# Altium schematic sheet MB_downlink_phy.SchDoc
size A4
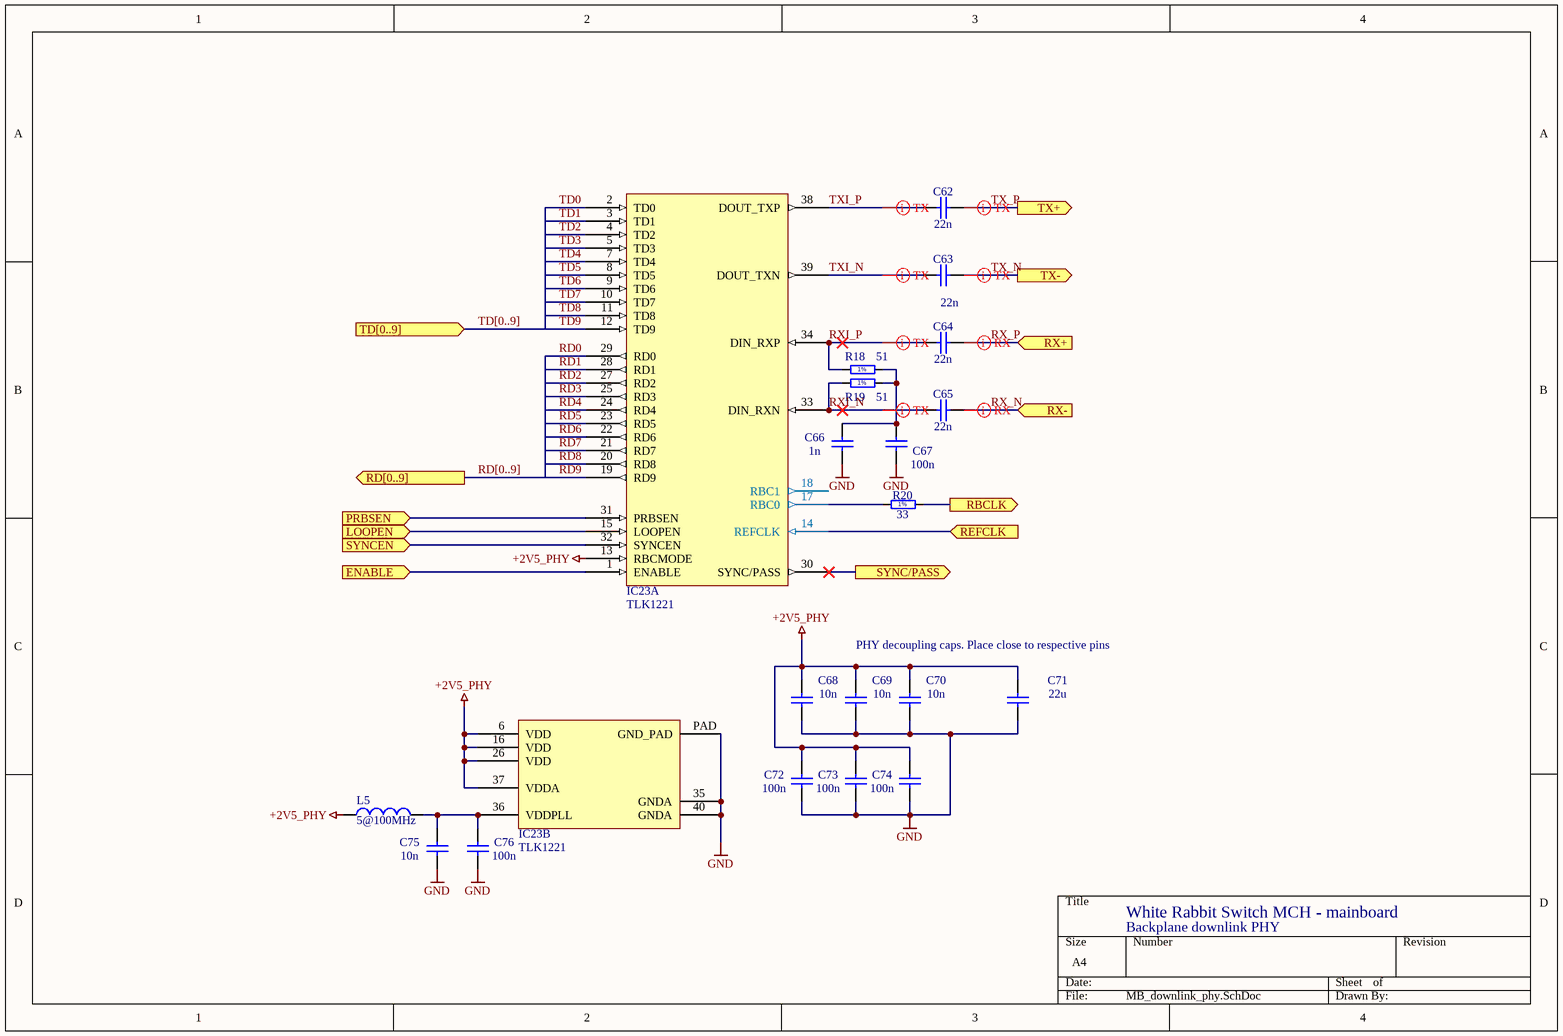
[diagram p0: MB_downlink_phy.SchDoc]

## Parts
C62  22n  [CAPC1005X55N]
C63  22n  [CAPC1005X55N]
C64  22n  [CAPC1005X55N]
C65  22n  [CAPC1005X55N]
C66  1n  [CAPC1005X55N]
C67  100n  [CAPC1005X55N]
C68  10n  [CAPC1005X55N]
C69  10n  [CAPC1005X55N]
C70  10n  [CAPC1005X55N]
C71  22u  [CAPC2012X135N]
C72  100n  [CAPC1005X55N]
C73  100n  [CAPC1005X55N]
C74  100n  [CAPC1005X55N]
C75  10n  [CAPC1005X55N]
C76  100n  [CAPC1005X55N]
IC23  TLK1221  [QFN40_powerpad]  (parts A,B of 2)
L5  value 5@100MHz  [INDC1608-0603]  (hidden comment: Inductor)
R18  51  [RESC1005X40N]
R19  51  [RESC1005X40N]
R20  33  [RESC1005X40N]

## Ports
ENABLE (in), LOOPEN (in), PRBSEN (in), RBCLK (out), RD[0..9] (out), REFCLK (in), RX+ (in), RX- (in), SYNC/PASS (out), SYNCEN (in), TD[0..9] (in), TX+ (out), TX- (out)

## Nets
+2V5_PHY: C68.2 C69.2 C70.2 C71.2 C72.2 C73.2 C74.2 IC23.6(VDD) IC23.13(RBCMODE) IC23.16(VDD) IC23.26(VDD) IC23.37(VDDA) L5.1
GND: C66.1 C67.1 C68.1 C69.1 C70.1 C71.1 C72.1 C73.1 C74.1 C75.1 C76.1 IC23.35(GNDA) IC23.40(GNDA) IC23.PAD(GND_PAD)
ENABLE: IC23.1(ENABLE) ; port ENABLE
LOOPEN: IC23.15(LOOPEN) ; port LOOPEN
PRBSEN: IC23.31(PRBSEN) ; port PRBSEN
RBCLK: R20.2 ; port RBCLK
RD0: IC23.29(RD0)
RD1: IC23.28(RD1)
RD2: IC23.27(RD2)
RD3: IC23.25(RD3)
RD4: IC23.24(RD4)
RD5: IC23.23(RD5)
RD6: IC23.22(RD6)
RD7: IC23.21(RD7)
RD8: IC23.20(RD8)
RD9: IC23.19(RD9)
REFCLK: IC23.14(REFCLK) ; port REFCLK
RX_N: C65.2 ; port RX-
RX_P: C64.2 ; port RX+
RXI_N: C65.1 IC23.33(DIN_RXN) R19.1
RXI_P: C64.1 IC23.34(DIN_RXP) R18.1
SYNC/PASS: IC23.30(SYNC/PASS) ; port SYNC/PASS
SYNCEN: IC23.32(SYNCEN) ; port SYNCEN
TD0: IC23.2(TD0)
TD1: IC23.3(TD1)
TD2: IC23.4(TD2)
TD3: IC23.5(TD3)
TD4: IC23.7(TD4)
TD5: IC23.8(TD5)
TD6: IC23.9(TD6)
TD7: IC23.10(TD7)
TD8: IC23.11(TD8)
TD9: IC23.12(TD9)
TX_N: C63.2 ; port TX-
TX_P: C62.2 ; port TX+
TXI_N: C63.1 IC23.39(DOUT_TXN)
TXI_P: C62.1 IC23.38(DOUT_TXP)
NetC66_2: C66.2 C67.2 R18.2 R19.2
NetC75_2: C75.2 C76.2 IC23.36(VDDPLL) L5.2
NetIC23_17: IC23.17(RBC0) R20.1

Not connected (* = marked no-connect by the designer): IC23 18(RBC1)

## Buses and harness runs
bus RD[0..9] = port RD[0..9]
bus TD[0..9] = port TD[0..9]

## Layout directives
differential pair: RX_N, RX_P, RXI_N, RXI_P, TX_N, TX_P, TXI_N, TXI_P

## Notes on the sheet
- PHY decoupling caps. Place close to respective pins
- White Rabbit Switch MCH - mainboard
- Backplane downlink PHY
- (in symbol R0402_33R_1%_0.0625W_100PPM) 1%
- (in symbol R0402_51R_1%_0.0625W_100PPM) 1%

## Library data of the parts
C62-C65 = CC0402_22NF_16V_10%_X7R: Non-polarised capacitor; Part Description: SMD Multilayer Chip Ceramic Capacitor; Manufacturer: GENERIC; Manufacturer1 Part Number: 223878715641; Manufacturer1 Datasheet: \\cern.ch\dfs\Applications\Altium\Datasheets\CC0402_X7R_PHYCOMP.pdf; Value: 22nF; Voltage: 16V; TC: X7R; Tolerance: ±10%; Table: Capacitors SMD; Part Number: CC0402_22NF_16V_10%_X7R; Component Kind: Standard; Component Type: Standard; Designator: Capacitor - non polarized; Library Reference: Capacitor - non polarized; Pin Count: 2; Status: Not Recommended; Manufacturer Part Number: CC0402_22NF_16V_10%_X7R; Case: 0402; Mounted: Yes; Socket: No; SMD: Yes; Manufacturer1 Example: PHYCOMP; Manufacturer1 ComponentHeight: 0.55mm; HelpURL: \\cern.ch\dfs\Applications\Altium\Datasheets\CC0402_X7R_PHYCOMP.pdf; Author: CERN DEM JLC; CreateDate: 12/3/2007; LatestRevisionDate: 12/3/2007
C66 = CC0402_1.0NF_50V_10%_X7R: Non-polarised capacitor; Part Description: SMD Multilayer Chip Ceramic Capacitor; Manufacturer: GENERIC; Manufacturer1 Part Number: 223858715623; Manufacturer1 Datasheet: \\cern.ch\dfs\Applications\Altium\Datasheets\CC0402_X7R_PHYCOMP.pdf; Value: 1nF; Voltage: 50V; TC: X7R; Tolerance: ±10%; Table: Capacitors SMD; Part Number: CC0402_1.0NF_50V_10%_X7R; Component Kind: Standard; Component Type: Standard; Designator: Capacitor - non polarized; Library Reference: Capacitor - non polarized; Pin Count: 2; Status: Not Recommended; Manufacturer Part Number: CC0402_1.0NF_50V_10%_X7R; Case: 0402; Mounted: Yes; Socket: No; SMD: Yes; Manufacturer1 Example: PHYCOMP; Manufacturer1 ComponentHeight: 0.55mm; HelpURL: \\cern.ch\dfs\Applications\Altium\Datasheets\CC0402_X7R_PHYCOMP.pdf; Author: CERN DEM JLC; CreateDate: 12/3/2007; LatestRevisionDate: 12/3/2007
C67 C72-C74 C76 = CC0402_100NF_16V_10%_X7R: Non-polarised capacitor; Part Description: SMD Multilayer Chip Ceramic Capacitor; Manufacturer: GENERIC; Manufacturer1 Part Number: 223878715649; Manufacturer1 Datasheet: \\cern.ch\dfs\Applications\Altium\Datasheets\CC0402_X7R_PHYCOMP.pdf; Value: 100nF; Voltage: 16V; TC: X7R; Tolerance: ±10%; Table: Capacitors SMD; Part Number: CC0402_100NF_16V_10%_X7R; Component Kind: Standard; Component Type: Standard; Designator: Capacitor - non polarized; Library Reference: Capacitor - non polarized; Pin Count: 2; Status: Not Recommended; Manufacturer Part Number: CC0402_100NF_16V_10%_X7R; Case: 0402; Mounted: Yes; Socket: No; SMD: Yes; Manufacturer1 Example: PHYCOMP; Manufacturer1 ComponentHeight: 0.55mm; HelpURL: \\cern.ch\dfs\Applications\Altium\Datasheets\CC0402_X7R_PHYCOMP.pdf; Author: CERN DEM JLC; CreateDate: 12/3/2007; LatestRevisionDate: 12/3/2007
C68-C70 C75 = CC0402_10NF_16V_10%_X7R: Non-polarised capacitor; Part Description: SMD Multilayer Chip Ceramic Capacitor; Manufacturer: GENERIC; Manufacturer1 Part Number: 223878715636; Manufacturer1 Datasheet: \\cern.ch\dfs\Applications\Altium\Datasheets\CC0402_X7R_PHYCOMP.pdf; Value: 10nF; Voltage: 16V; TC: X7R; Tolerance: ±10%; Table: Capacitors SMD; Part Number: CC0402_10NF_16V_10%_X7R; Component Kind: Standard; Component Type: Standard; Designator: Capacitor - non polarized; Library Reference: Capacitor - non polarized; Pin Count: 2; Status: Not Recommended; Manufacturer Part Number: CC0402_10NF_16V_10%_X7R; Case: 0402; Mounted: Yes; Socket: No; SMD: Yes; Manufacturer1 Example: PHYCOMP; Manufacturer1 ComponentHeight: 0.55mm; HelpURL: \\cern.ch\dfs\Applications\Altium\Datasheets\CC0402_X7R_PHYCOMP.pdf; Author: CERN DEM JLC; CreateDate: 12/3/2007; LatestRevisionDate: 12/3/2007
C71 = CC0805_22uF_6.3V_20%_X5R: Non-polarised capacitor; Part Description: SMD Multilayer Chip Ceramic Capacitor; Manufacturer: GENERIC; Manufacturer1 Part Number: C0805C226M9PAC7800; Manufacturer1 Datasheet: \\cern.ch\dfs\Applications\Altium\Datasheets\CC1206_X5R_KEMET.pdf; Value: 22uF; Voltage: 6.3V; TC: X5R; Tolerance: ±20%; Table: Capacitors SMD; Part Number: CC0805_22uF_6.3V_20%_X5R; Component Kind: Standard; Component Type: Standard; Designator: Capacitor - non polarized; Library Reference: Capacitor - non polarized; Pin Count: 2; Status: Preferred; Manufacturer Part Number: CC0805_22uF_6.3V_20%_X5R; Case: 0805; Mounted: Yes; Socket: No; SMD: Yes; Manufacturer1 Example: KEMET; Manufacturer1 ComponentHeight: 1.45mm; HelpURL: \\cern.ch\dfs\Applications\Altium\Datasheets\CC1206_X5R_KEMET.pdf; Author: CERN DEM JLC; CreateDate: 12/3/2007; LatestRevisionDate: 12/3/2007
IC23 = TLK1221: Texas Instruments Gigabit Ethernet PHY with deterministic clocking and LVPECL output interface; RefId: 1576976; Value: TLK1221RHAT; Supplier: Farnell
L5 = Inductor: Ferrite bead; Published: 8-Jun-2000; Revision: July-2002: Re-released for DXP Platform.; Publisher: Altium Limited
R18 R19 = R0402_51R_1%_0.0625W_100PPM: Resistor - 1%; Part Description: General Purpose Thick Film Chip Resistor; Manufacturer: GENERIC; Manufacturer1 Part Number: 232270675109; Manufacturer1 Datasheet: \\cern.ch\dfs\Applications\Altium\Datasheets\R0402_Phycomp_RC0402.pdf; TC: ±100ppm/°C; Table: Resistors SMD; Part Number: R0402_51R_1%_0.0625W_100PPM; Component Kind: Standard; Component Type: Standard; Designator: Resistor - 1%; Library Reference: Resistor - 1%; Pin Count: 2; Value: 51; Status: Not recommended; Power: 0.0625W; Tolerance: ±1%; Manufacturer Part Number: R0402_51R_1%_0.0625W_100PPM; Case: 0402; Mounted: Yes; Socket: No; SMD: Yes; Manufacturer1 Example: PHYCOMP; Manufacturer1 ComponentHeight: 0.4mm; HelpURL: \\cern.ch\dfs\Applications\Altium\Datasheets\R0402_Phycomp_RC0402.pdf; Author: CERN DEM JLC; CreateDate: 12/3/2007; LatestRevisionDate: 3/13/2008
R20 = R0402_33R_1%_0.0625W_100PPM: Resistor - 1%; Part Description: General Purpose Thick Film Chip Resistor; Manufacturer: GENERIC; Manufacturer1 Part Number: 232270673309; Manufacturer1 Datasheet: \\cern.ch\dfs\Applications\Altium\Datasheets\R0402_Phycomp_RC0402.pdf; TC: ±100ppm/°C; Table: Resistors SMD; Part Number: R0402_33R_1%_0.0625W_100PPM; Component Kind: Standard; Component Type: Standard; Designator: Resistor - 1%; Library Reference: Resistor - 1%; Pin Count: 2; Value: 33; Status: Not recommended; Power: 0.0625W; Tolerance: ±1%; Manufacturer Part Number: R0402_33R_1%_0.0625W_100PPM; Case: 0402; Mounted: Yes; Socket: No; SMD: Yes; Manufacturer1 Example: PHYCOMP; Manufacturer1 ComponentHeight: 0.4mm; HelpURL: \\cern.ch\dfs\Applications\Altium\Datasheets\R0402_Phycomp_RC0402.pdf; Author: CERN DEM JLC; CreateDate: 12/3/2007; LatestRevisionDate: 3/13/2008